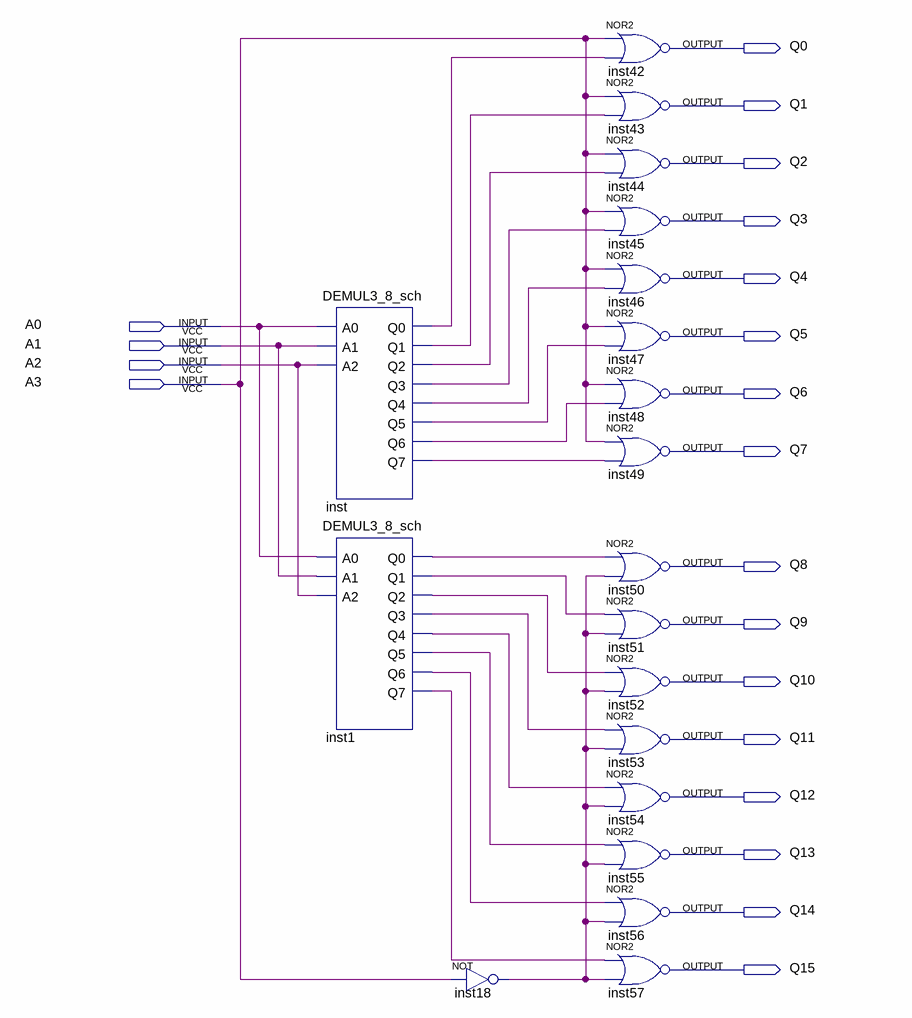
[diagram p0: schematic sheet]
// Quartus schematic DEMUL4_16_sch.bdf as structural Verilog: 19 symbols, 20 pins
module DEMUL4_16_sch (
  input  A0,
  input  A1,
  input  A2,
  input  A3,
  output Q0,
  output Q1,
  output Q2,
  output Q3,
  output Q4,
  output Q5,
  output Q6,
  output Q7,
  output Q8,
  output Q9,
  output Q10,
  output Q11,
  output Q12,
  output Q13,
  output Q14,
  output Q15
);

  wire inst1_q0, inst1_q1, inst1_q2, inst1_q3, inst1_q4, inst1_q5, inst1_q6, inst1_q7, inst18_out, inst_q0,
       inst_q1, inst_q2, inst_q3, inst_q4, inst_q5, inst_q6, inst_q7;

  DEMUL3_8_sch inst (
    .A0(A0), .A1(A1), .A2(A2), .Q0(inst_q0), .Q1(inst_q1), .Q2(inst_q2), .Q3(inst_q3), .Q4(inst_q4),
    .Q5(inst_q5), .Q6(inst_q6), .Q7(inst_q7));
  DEMUL3_8_sch inst1 (
    .A0(A0), .A1(A1), .A2(A2), .Q0(inst1_q0), .Q1(inst1_q1), .Q2(inst1_q2), .Q3(inst1_q3), .Q4(inst1_q4),
    .Q5(inst1_q5), .Q6(inst1_q6), .Q7(inst1_q7));
  not inst18 (inst18_out, A3);
  nor inst42 (Q0, A3, inst_q0);
  nor inst43 (Q1, A3, inst_q1);
  nor inst44 (Q2, A3, inst_q2);
  nor inst45 (Q3, A3, inst_q3);
  nor inst46 (Q4, A3, inst_q4);
  nor inst47 (Q5, A3, inst_q5);
  nor inst48 (Q6, A3, inst_q6);
  nor inst49 (Q7, A3, inst_q7);
  nor inst50 (Q8, inst1_q0, inst18_out);
  nor inst51 (Q9, inst1_q1, inst18_out);
  nor inst52 (Q10, inst1_q2, inst18_out);
  nor inst53 (Q11, inst1_q3, inst18_out);
  nor inst54 (Q12, inst1_q4, inst18_out);
  nor inst55 (Q13, inst1_q5, inst18_out);
  nor inst56 (Q14, inst1_q6, inst18_out);
  nor inst57 (Q15, inst1_q7, inst18_out);
endmodule
